# EAGLE design LB_w19_SPLIT_OUT-v03(rev1_1) (EAGLE 6.6.0)
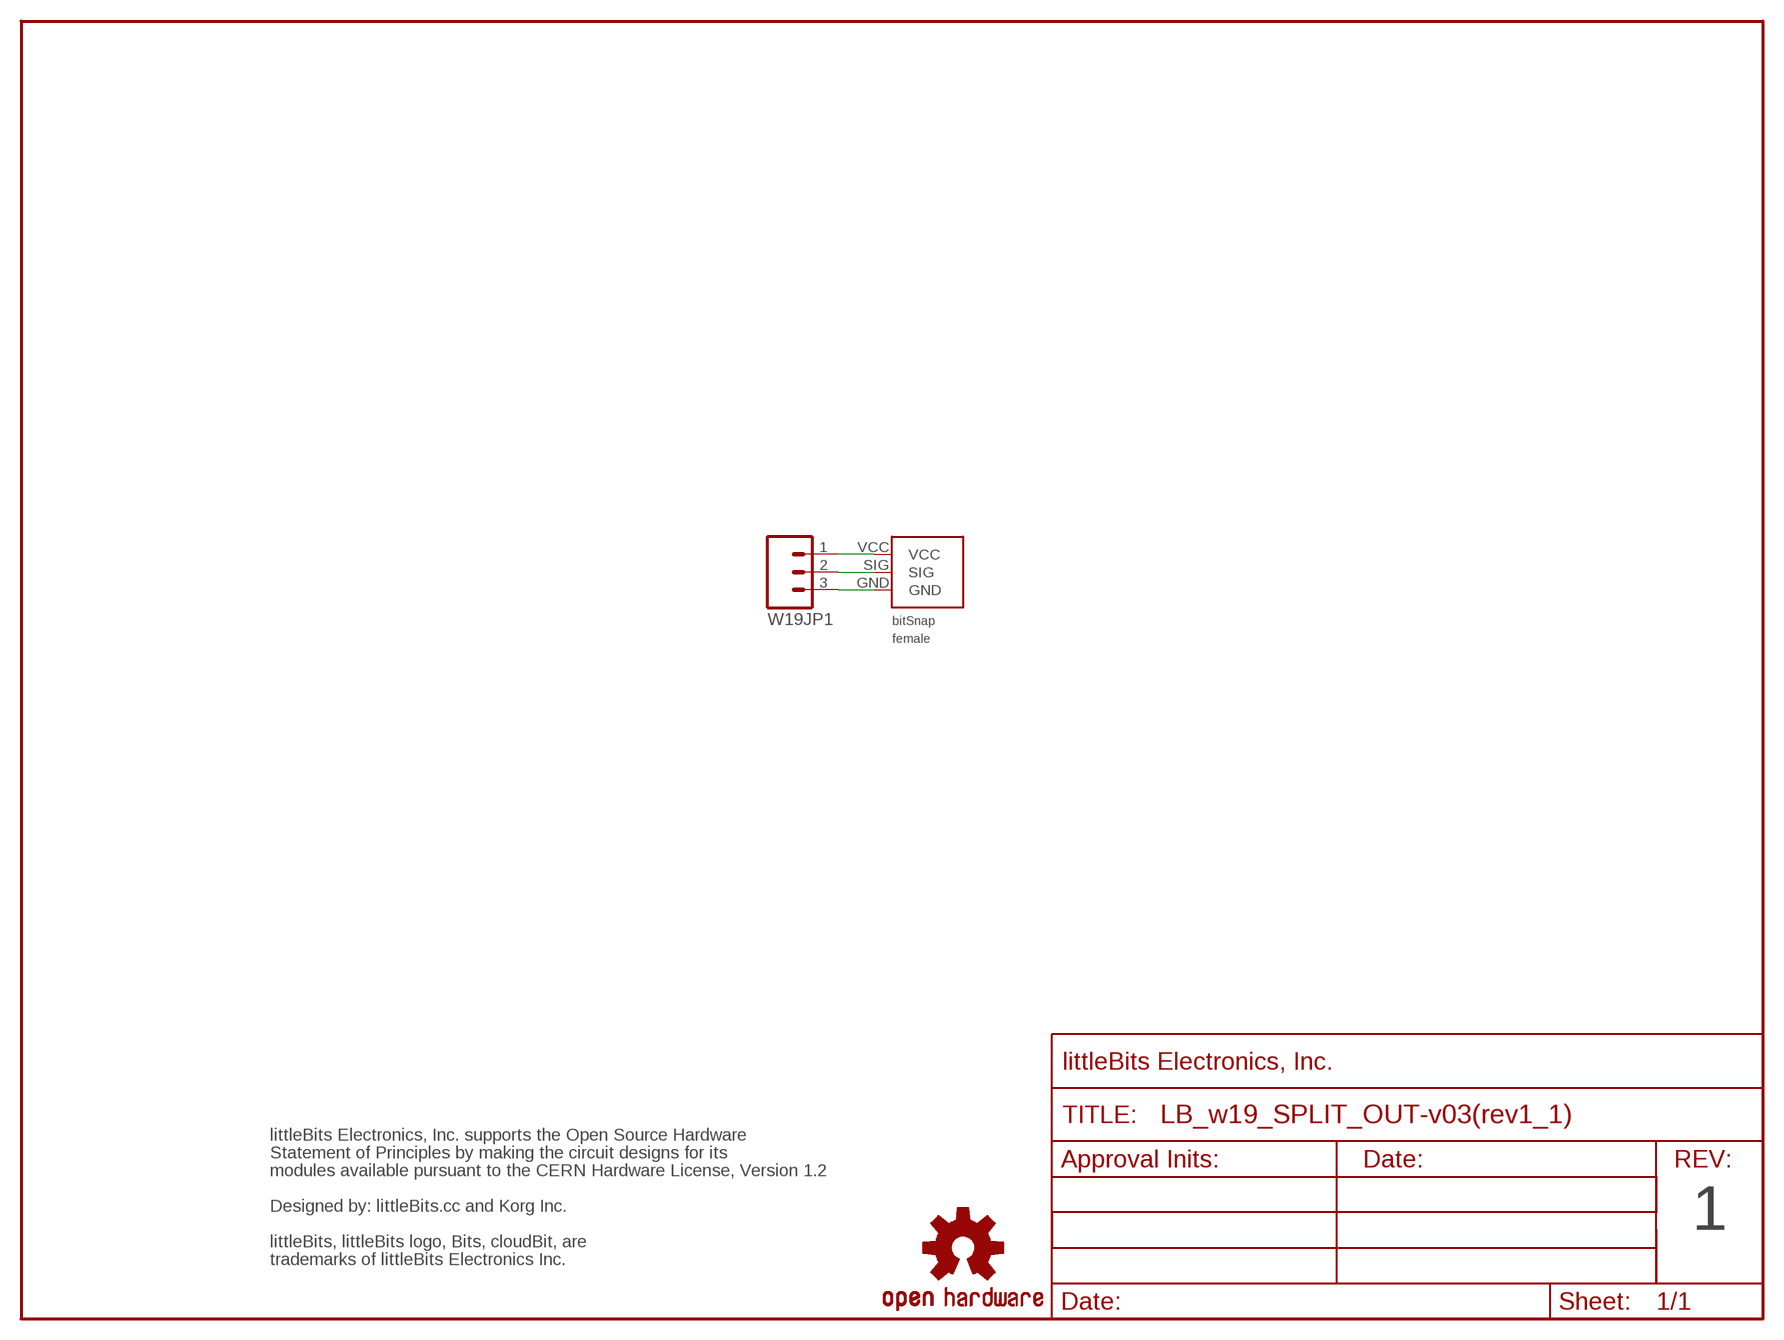
[diagram p0: schematic, sheet 1]

## Parts
FRAME1  FRAME-LETTER-OHWOHW  [FABDWG01-OHW]
U$1  OSHWCREDIT-KORG  [OSHWCREDIT-KORG]
U$3  OSHW-LOGOL  [OSHW-LOGO-L]
W19BSF1  BITSNAP_V03_FEMALE  [BITSNAP_V03_FEMALE]
W19JP1  M03SMD  [1X03-1MM-RA]

## Nets
GND: W19BSF1.GND W19JP1.3
SIG: W19BSF1.SIG W19JP1.2
VCC: W19BSF1.VCC W19JP1.1

## Notes on the sheet
- 1

## Library data of the parts
FRAME1 = LITTLEBITS:FRAME-LETTER-OHW
U$1 = LITTLEBITS:OSHWCREDIT-KORG
U$3 = SparkFun:OSHW-LOGO: Open Source Hardware Logo This logo indicates the piece of hardware it is found on incorporates a OSHW license and/or adheres to the definition of open source hardware found here: http://freedomdefined.org/OSHW
W19BSF1 = bitSnap:BITSNAP_V03_FEMALE
W19JP1 = SparkFun:M03: Header 3 Standard 3-pin 0.1" header. Use with straight break away headers (SKU : PRT-00116), right angle break away headers (PRT-00553), swiss pins (PRT-00743), machine pins (PRT-00117), and female headers (PRT-00115). Molex polarized connector foot print use with SKU : PRT-08232 with associated crimp pins and housings.

## Board
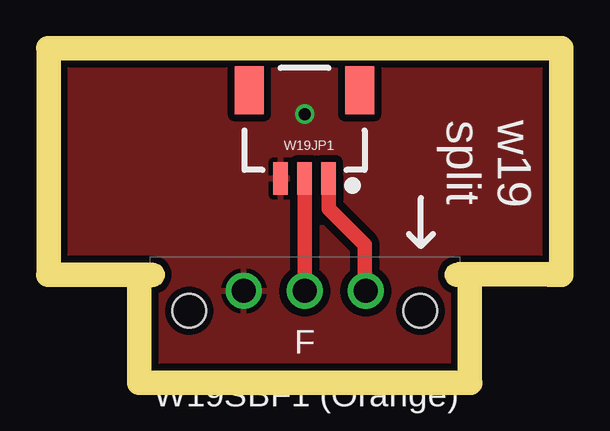
[diagram p1: board, top side]
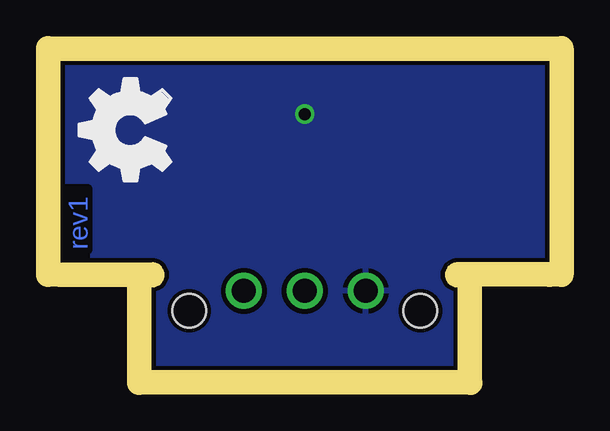
[diagram p2: board, bottom side, seen from below]

Size 20.4 x 12.95 mm. Coordinates in mm from the lower left corner, seen from the top.
Outline: 20.4,4.5 20.4,12.95 0,12.95 0,4.5
Copper layers (1*16): Top 0.035mm / dielectric 1.5mm / Bottom 0.035mm
Design rules "littleBitsDRC": minimum track width 0.2mm, minimum drill 0.4mm, track to track 0.2mm, track to pad 0.2mm, pad to pad 0.2mm, via to via 0.2mm, smd to smd 0mil, copper to edge 0.2mm, drill to drill 0.2mm, minimum pad ring 0.2mm, minimum via ring 0.15mm, stop-mask expansion 0.1mm, vias tented up to drill 0mil, thermal gap 0.2mm
Milling: 5 lines

### Footprints (pad centres in the part's own frame; a part is rotated, then mirrored left to right if it is on the bottom)
BITSNAP_V03_FEMALE = drill 1: GND 3.91,3.33; SIG 6.45,3.33; VCC 8.99,3.33 | hole 1.4: 1.63,2.5; 11.27,2.5
1X03-1MM-RA = smd 0.6 x 1.35: 1 -1,0; 2 0,0; 3 1,0 | smd 1.2 x 2: NC1 2.3,-3.675; NC2 -2.3,-3.675

### Placement (x,y rotation side)
FRAME1  0,0 0 top
U$1  -77.35,-71.5 0 top  (outside the outline)
U$2  [OSHW_FILLX150_NOTEXT]  15.79,7.08 0 top
U$3  -25.34,-72.09 0 top  (outside the outline)
W19BSF1  3.75,0 0 top
W19JP1  10.19,8.02 180 top

### Tracks (layer width: path | path; a pad name or v marks a point on that pad's centre or on a via)
GND  (via drill 0.5)
  other vias: 10.2,10.7
  pour Top (isolate 0.305): 20.25,0.16 20.25,12.8 0.23,12.75 0.18,0.16
  pour Bottom: 20.25,0.15 0.15,0.15 0.15,12.8 20.25,12.8
SIG
  Top 0.61: W19JP1.2 10.19,2.96 W19BSF1.SIG
VCC
  Top 0.61: W19JP1.1 11.19,6.76 12.7,5.25 12.7,3 W19BSF1.VCC

### Text on the board
Bottom: rev1
tPlace: w19 / split
tNames: W19SBF1 (Orange)
dxf: 1